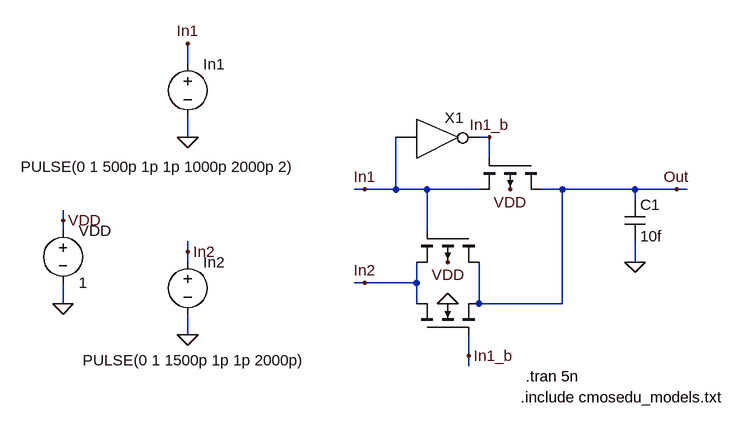
[diagram p0: schematic 9-TG-OR.asc]
9-TG-OR.asc, the LTspice schematic file:
Version 4
SHEET 1 1820 680
WIRE 480 -688 480 -720
WIRE 480 -576 480 -608
WIRE 944 -576 928 -576
WIRE 944 -544 944 -576
WIRE 752 -496 736 -496
WIRE 800 -496 800 -576
WIRE 800 -496 752 -496
WIRE 848 -496 800 -496
WIRE 928 -496 848 -496
WIRE 1056 -496 1024 -496
WIRE 1168 -496 1056 -496
WIRE 1232 -496 1168 -496
WIRE 1248 -496 1232 -496
WIRE 1168 -480 1168 -496
WIRE 288 -448 288 -464
WIRE 288 -432 288 -448
WIRE 848 -432 848 -496
WIRE 480 -400 480 -416
WIRE 480 -384 480 -400
WIRE 1168 -384 1168 -416
WIRE 752 -352 736 -352
WIRE 832 -352 832 -384
WIRE 832 -352 752 -352
WIRE 288 -320 288 -352
WIRE 832 -320 832 -352
WIRE 928 -320 928 -384
WIRE 1056 -320 1056 -496
WIRE 1056 -320 928 -320
WIRE 480 -272 480 -304
WIRE 912 -240 912 -272
WIRE 912 -224 912 -240
FLAG 288 -320 0
FLAG 288 -448 VDD
FLAG 880 -320 0
FLAG 880 -384 VDD
FLAG 976 -496 VDD
FLAG 1168 -384 0
FLAG 1232 -496 Out
FLAG 480 -576 0
FLAG 480 -272 0
FLAG 480 -720 In1
FLAG 480 -400 In2
FLAG 752 -496 In1
FLAG 752 -352 In2
FLAG 944 -576 In1_b
FLAG 912 -240 In1_b
SYMBOL voltage 288 -448 R0
WINDOW 123 24 126 Left 2
WINDOW 39 24 111 Left 2
SYMATTR InstName VDD
SYMATTR Value 1
SYMBOL nmos4 832 -272 R270
WINDOW 0 86 42 Invisible 2
WINDOW 3 82 140 Invisible 2
SYMATTR InstName M7
SYMATTR Value N_50n
SYMATTR Value2 l=50n w=500n
SYMBOL pmos4 928 -432 R90
WINDOW 0 71 26 Invisible 2
WINDOW 3 75 133 Invisible 2
SYMATTR InstName M3
SYMATTR Value P_50n
SYMATTR Value2 l=50n w=1u
SYMBOL pmos4 1024 -544 R90
WINDOW 0 71 26 Invisible 2
WINDOW 3 75 133 Invisible 2
SYMATTR InstName M14
SYMATTR Value P_50n
SYMATTR Value2 l=50n w=1u
SYMBOL cap 1152 -480 R0
SYMATTR InstName C1
SYMATTR Value 10f
SYMBOL NOT 832 -608 R0
SYMATTR InstName X1
SYMBOL voltage 480 -704 R0
WINDOW 3 -257 173 Left 2
SYMATTR Value PULSE(0 1 500p 1p 1p 1000p 2000p 2)
SYMATTR InstName In1
SYMBOL voltage 480 -400 R0
WINDOW 3 -162 167 Left 2
SYMATTR Value PULSE(0 1 1500p 1p 1p 2000p)
SYMATTR InstName In2
TEXT 992 -176 Left 2 !.include cmosedu_models.txt
TEXT 1000 -208 Left 2 !.tran 5n

The netlist it stands for:
* 9-TG-OR.asc
VDD VDD 0 1
M7 In2 In1_b Out 0 N_50n l=50n w=500n
M3 Out In1 In2 VDD P_50n l=50n w=1u
M14 Out In1_b In1 VDD P_50n l=50n w=1u
C1 Out 0 10f
XX1 In1 In1_b NOT  ; pins In Out
V§In1 In1 0 PULSE(0 1 500p 1p 1p 1000p 2000p 2)
V§In2 In2 0 PULSE(0 1 1500p 1p 1p 2000p)
.model NMOS NMOS
.model PMOS PMOS
.lib standard.mos
.include cmosedu_models.txt
.tran 5n
.backanno
.end